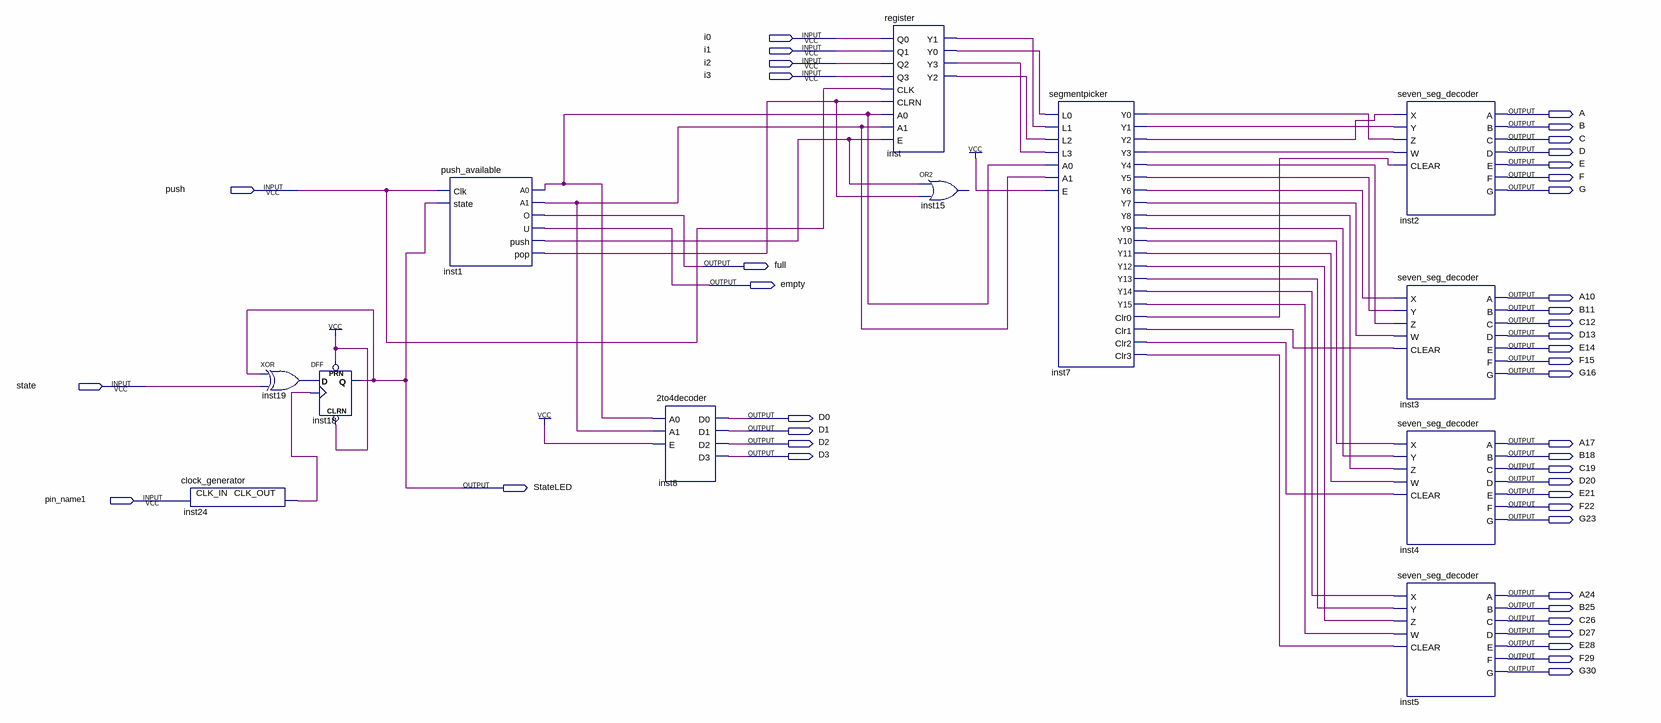
[diagram p0: schematic sheet]
// Quartus schematic finalProj.bdf as structural Verilog: 12 symbols, 42 pins
module finalProj (
  input  i0,
  input  i1,
  input  i2,
  input  i3,
  input  push,
  input  state,
  input  pin_name1,
  output A,
  output B,
  output C,
  output D,
  output E,
  output F,
  output G,
  output full,
  output empty,
  output A10,
  output B11,
  output C12,
  output D13,
  output E14,
  output F15,
  output G16,
  output D0,
  output D1,
  output D2,
  output A17,
  output D3,
  output B18,
  output C19,
  output D20,
  output StateLED,
  output E21,
  output F22,
  output G23,
  output A24,
  output B25,
  output C26,
  output D27,
  output E28,
  output F29,
  output G30
);

  wire inst1_a0, inst1_a1, inst1_pop, inst1_push, inst7_clr0, inst7_clr1, inst7_clr2, inst7_clr3, inst7_y0,
       inst7_y1, inst7_y2, inst7_y3, inst7_y4, inst7_y5, inst7_y6, inst7_y7, inst7_y8, inst7_y9, inst7_y10,
       inst7_y11, inst7_y12, inst7_y13, inst7_y14, inst7_y15, inst19_out, inst24_clk_out, inst_y0, inst_y1,
       inst_y2, inst_y3;

  clock_generator inst24 (.CLK_IN(pin_name1), .CLK_OUT(inst24_clk_out));
  xor inst19 (inst19_out, StateLED, state);
  DFF inst18 (.CLRN(1'b1), .CLK(inst24_clk_out), .D(inst19_out), .PRN(1'b1), .Q(StateLED));
  push_available inst1 (
    .Clk(push), .state(StateLED), .A0(inst1_a0), .A1(inst1_a1), .O(full), .U(empty), .push(inst1_push),
    .pop(inst1_pop));
  \2to4decoder  inst8 (.A0(inst1_a0), .A1(inst1_a1), .E(1'b1), .D0(D0), .D1(D1), .D2(D2), .D3(D3));
  register inst (
    .Q0(i0), .Q1(i1), .Q2(i2), .Q3(i3), .CLK(push), .CLRN(inst1_pop), .A0(inst1_a0), .A1(inst1_a1),
    .E(inst1_push), .Y1(inst_y1), .Y0(inst_y0), .Y3(inst_y3), .Y2(inst_y2));
  // OR2 inst15 has open pins: IN1=inst1_push, IN2=inst1_pop, OUT=open
  segmentpicker inst7 (
    .L0(inst_y0), .L1(inst_y1), .L2(inst_y2), .L3(inst_y3), .A0(inst1_a0), .A1(inst1_a1), .E(1'b1),
    .Y0(inst7_y0), .Y1(inst7_y1), .Y2(inst7_y2), .Y3(inst7_y3), .Y4(inst7_y4), .Y5(inst7_y5), .Y6(inst7_y6),
    .Y7(inst7_y7), .Y8(inst7_y8), .Y9(inst7_y9), .Y10(inst7_y10), .Y11(inst7_y11), .Y12(inst7_y12),
    .Y13(inst7_y13), .Y14(inst7_y14), .Y15(inst7_y15), .Clr0(inst7_clr0), .Clr1(inst7_clr1),
    .Clr2(inst7_clr2), .Clr3(inst7_clr3));
  seven_seg_decoder inst2 (
    .X(inst7_y2), .Y(inst7_y1), .Z(inst7_y0), .W(inst7_y3), .CLEAR(inst7_clr0), .A(A), .B(B), .C(C), .D(D),
    .E(E), .F(F), .G(G));
  seven_seg_decoder inst3 (
    .X(inst7_y6), .Y(inst7_y5), .Z(inst7_y4), .W(inst7_y7), .CLEAR(inst7_clr1), .A(A10), .B(B11), .C(C12),
    .D(D13), .E(E14), .F(F15), .G(G16));
  seven_seg_decoder inst4 (
    .X(inst7_y10), .Y(inst7_y9), .Z(inst7_y8), .W(inst7_y11), .CLEAR(inst7_clr2), .A(A17), .B(B18), .C(C19),
    .D(D20), .E(E21), .F(F22), .G(G23));
  seven_seg_decoder inst5 (
    .X(inst7_y14), .Y(inst7_y13), .Z(inst7_y12), .W(inst7_y15), .CLEAR(inst7_clr3), .A(A24), .B(B25),
    .C(C26), .D(D27), .E(E28), .F(F29), .G(G30));
endmodule
